# EAGLE schematic ba662 (EAGLE 7.2.0)
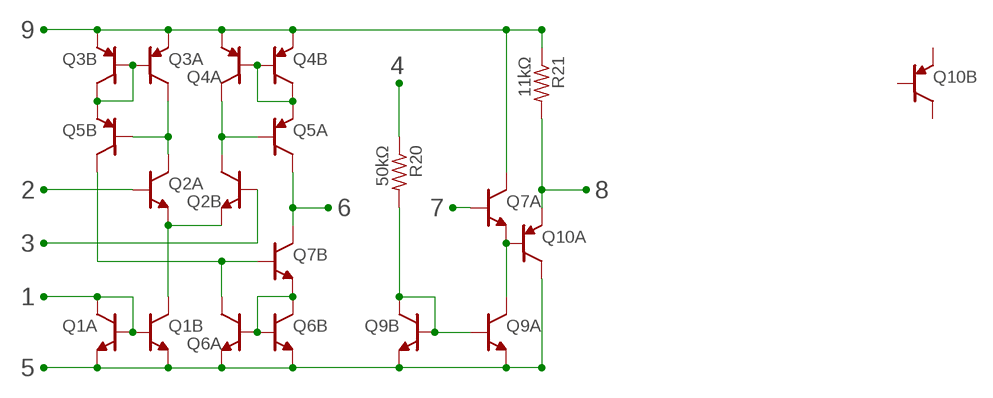
[diagram p0: schematic, sheet 1]

## Parts
Q1  NPN-DUALPMP4201  [SOT363]
Q2  NPN-DUALPMP4201  [SOT363]
Q3  PNP-DUALPMP5201  [SOT363]
Q4  PNP-DUALPMP5201  [SOT363]
Q5  PNP-DUALPMP5201  [SOT363]
Q6  NPN-DUALPMP4201  [SOT363]
Q7  NPN-DUALPMP4201  [SOT363]
Q9  NPN-DUALPMP4201  [SOT363]
Q10  PNP-DUALPMP5201  [SOT363]
R20  50kΩ  RESISTOR0603-SM  [0603-SM]
R21  11kΩ  RESISTOR0603-SM  [0603-SM]

## Nets
N$1: R20.P$1
N$2: Q1.P$4 Q1.P$5 Q6.P$4 Q6.P$5 Q9.P$4 Q9.P$5 Q10.P$6
N$3: Q7.P$1
N$87: Q1.P$1 Q1.P$2 Q1.P$6
N$91: Q1.P$3 Q2.P$4 Q2.P$5
N$94: Q4.P$1 Q4.P$2 Q4.P$3 Q5.P$5
N$95: Q3.P$1 Q3.P$2 Q3.P$3 Q5.P$4
N$96: Q2.P$3 Q4.P$6 Q5.P$1
N$97: Q6.P$1 Q6.P$2 Q6.P$3 Q7.P$4
N$98: Q5.P$6 Q7.P$3
N$100: Q2.P$6 Q3.P$6 Q5.P$2
N$101: Q5.P$3 Q6.P$6 Q7.P$2
N$102: Q9.P$1 Q9.P$2 Q9.P$3 R20.P$2
N$103: Q7.P$5 Q9.P$6 Q10.P$1
N$105: Q10.P$5 R21.P$2
N$127: Q2.P$2
N$128: Q2.P$1
V+: Q3.P$4 Q3.P$5 Q4.P$4 Q4.P$5 Q7.P$6 R21.P$1
Unconnected: Q10.P$2 Q10.P$3 Q10.P$4

## Notes on the sheet
- 9
- 4
- 2
- 7 | 8
- 6
- 3
- 1
- 5

## Library data of the parts
Q1 Q2 Q6 Q7 Q9 = audioint:NPN-DUAL
Q3-Q5 Q10 = audioint:PNP-DUAL
R20 R21 = audioint:RESISTOR